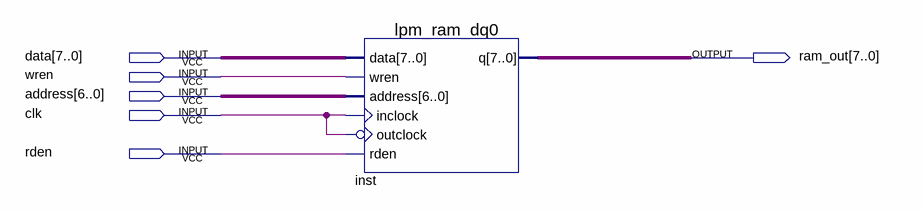
[diagram p0: schematic sheet]
// Quartus schematic BlockTest.bdf as structural Verilog: 1 symbols, 6 pins
module BlockTest (
  input  [7:0] data,
  input  wren,
  input  [6:0] address,
  input  clk,
  input  rden,
  output [7:0] ram_out
);

  lpm_ram_dq0 inst (
    .data(data), .wren(wren), .address(address), .inclock(clk), .outclock(~clk), .rden(rden), .q(ram_out));
endmodule
